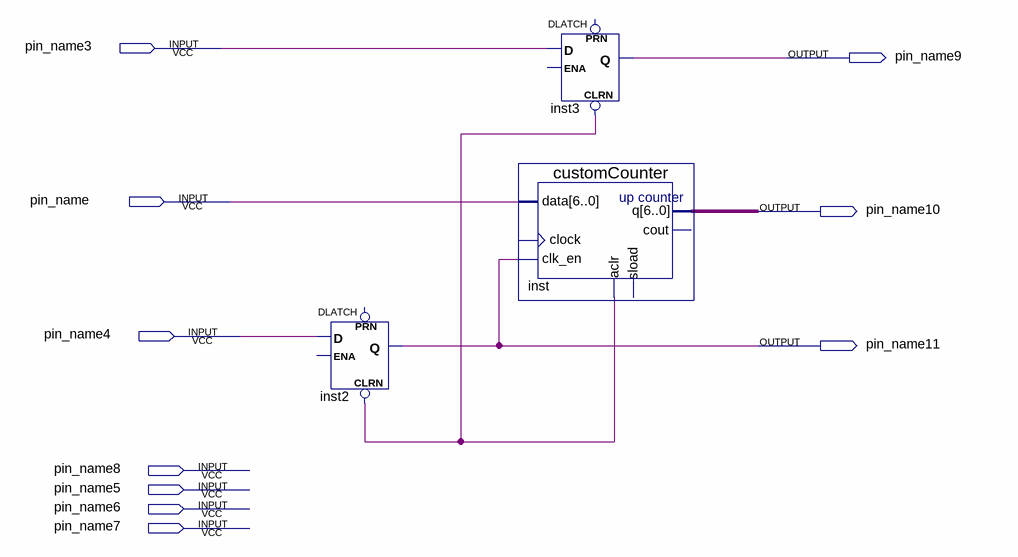
[diagram p0: schematic sheet]
// Quartus schematic keySubBuffert.bdf as structural Verilog: 3 symbols, 10 pins
module keySubBuffert (
  input  pin_name3,
  input  pin_name,
  input  pin_name4,
  input  pin_name8,
  input  pin_name5,
  input  pin_name6,
  input  pin_name7,
  output pin_name9,
  output pin_name10,
  output pin_name11
);

  wire undriven;
  wire [6:0] inst_q;

  DLATCH inst2 (.CLRN(undriven), .D(pin_name4), .Q(pin_name11));  // open: ENA, PRN
  DLATCH inst3 (.CLRN(undriven), .D(pin_name3), .Q(pin_name9));  // open: ENA, PRN
  customCounter inst (
    .data({7{pin_name}}), .clk_en(pin_name11), .aclr(undriven), .q(inst_q));  // open: clock, sload, cout
endmodule
